# EAGLE schematic 23Kxxx (EAGLE 6.2)
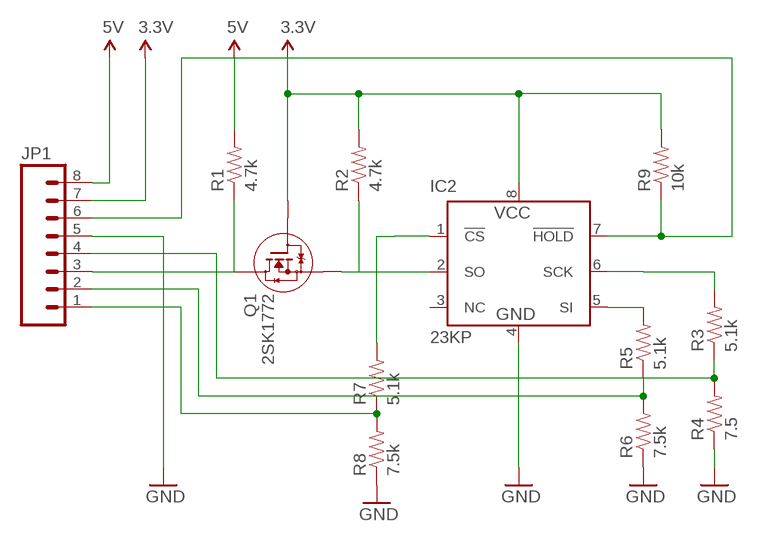
[diagram p0: schematic, sheet 1]

## Parts
IC2  23KP  [DIL8]
JP1  M081X08  [1X08]
Q1  2SK1772  [SOT89]
R1  4.7k  RESISTORAXIAL-0.3  [AXIAL-0.3]
R2  4.7k  RESISTORAXIAL-0.3  [AXIAL-0.3]
R3  5.1k  RESISTORAXIAL-0.3  [AXIAL-0.3]
R4  7.5  RESISTORAXIAL-0.3  [AXIAL-0.3]
R5  5.1k  RESISTORAXIAL-0.3  [AXIAL-0.3]
R6  7.5k  RESISTORAXIAL-0.3  [AXIAL-0.3]
R7  5.1k  RESISTORAXIAL-0.3  [AXIAL-0.3]
R8  7.5k  RESISTORAXIAL-0.3  [AXIAL-0.3]
R9  10k  RESISTORAXIAL-0.3  [AXIAL-0.3]

## Nets
3.3V: IC2.8(VCC) JP1.7 Q1.1(G) R2.P$2 R9.P$2
5V: JP1.8 R1.P$2
GND: IC2.4(GND) JP1.5 R4.P$1 R6.P$1 R8.P$1
N$1: JP1.3 Q1.2(D) Q1.2@1(D) R1.P$1
N$3: IC2.2(SO) Q1.3(S) R2.P$1
N$4: IC2.1(!CS) R7.P$2
N$5: IC2.7(!HOLD) JP1.6 R9.P$1
N$6: IC2.6(SCK) R3.P$2
N$7: JP1.4 R3.P$1 R4.P$2
N$8: JP1.2 R5.P$1 R6.P$2
N$9: IC2.5(SI) R5.P$2
N$11: JP1.1 R7.P$1 R8.P$2
Unconnected: IC2.3(NC)

## Library data of the parts
IC2 = My Library:23K***: Serial EEPROM 4 K, SPI bus
JP1 = SparkFun:M08: Header 8 Standard 8-pin 0.1" header. Use with straight break away headers (SKU : PRT-00116), right angle break away headers (PRT-00553), swiss pins (PRT-00743), machine pins (PRT-00117), and female headers (PRT-00115).
Q1 = My Library:2SK1772
R1-R9 = My Library:RESISTOR: Resistor Basic schematic elements and footprints for 0603, 1206, and PTH resistors.